# EAGLE design USBASP_M8535 (EAGLE 6.1)
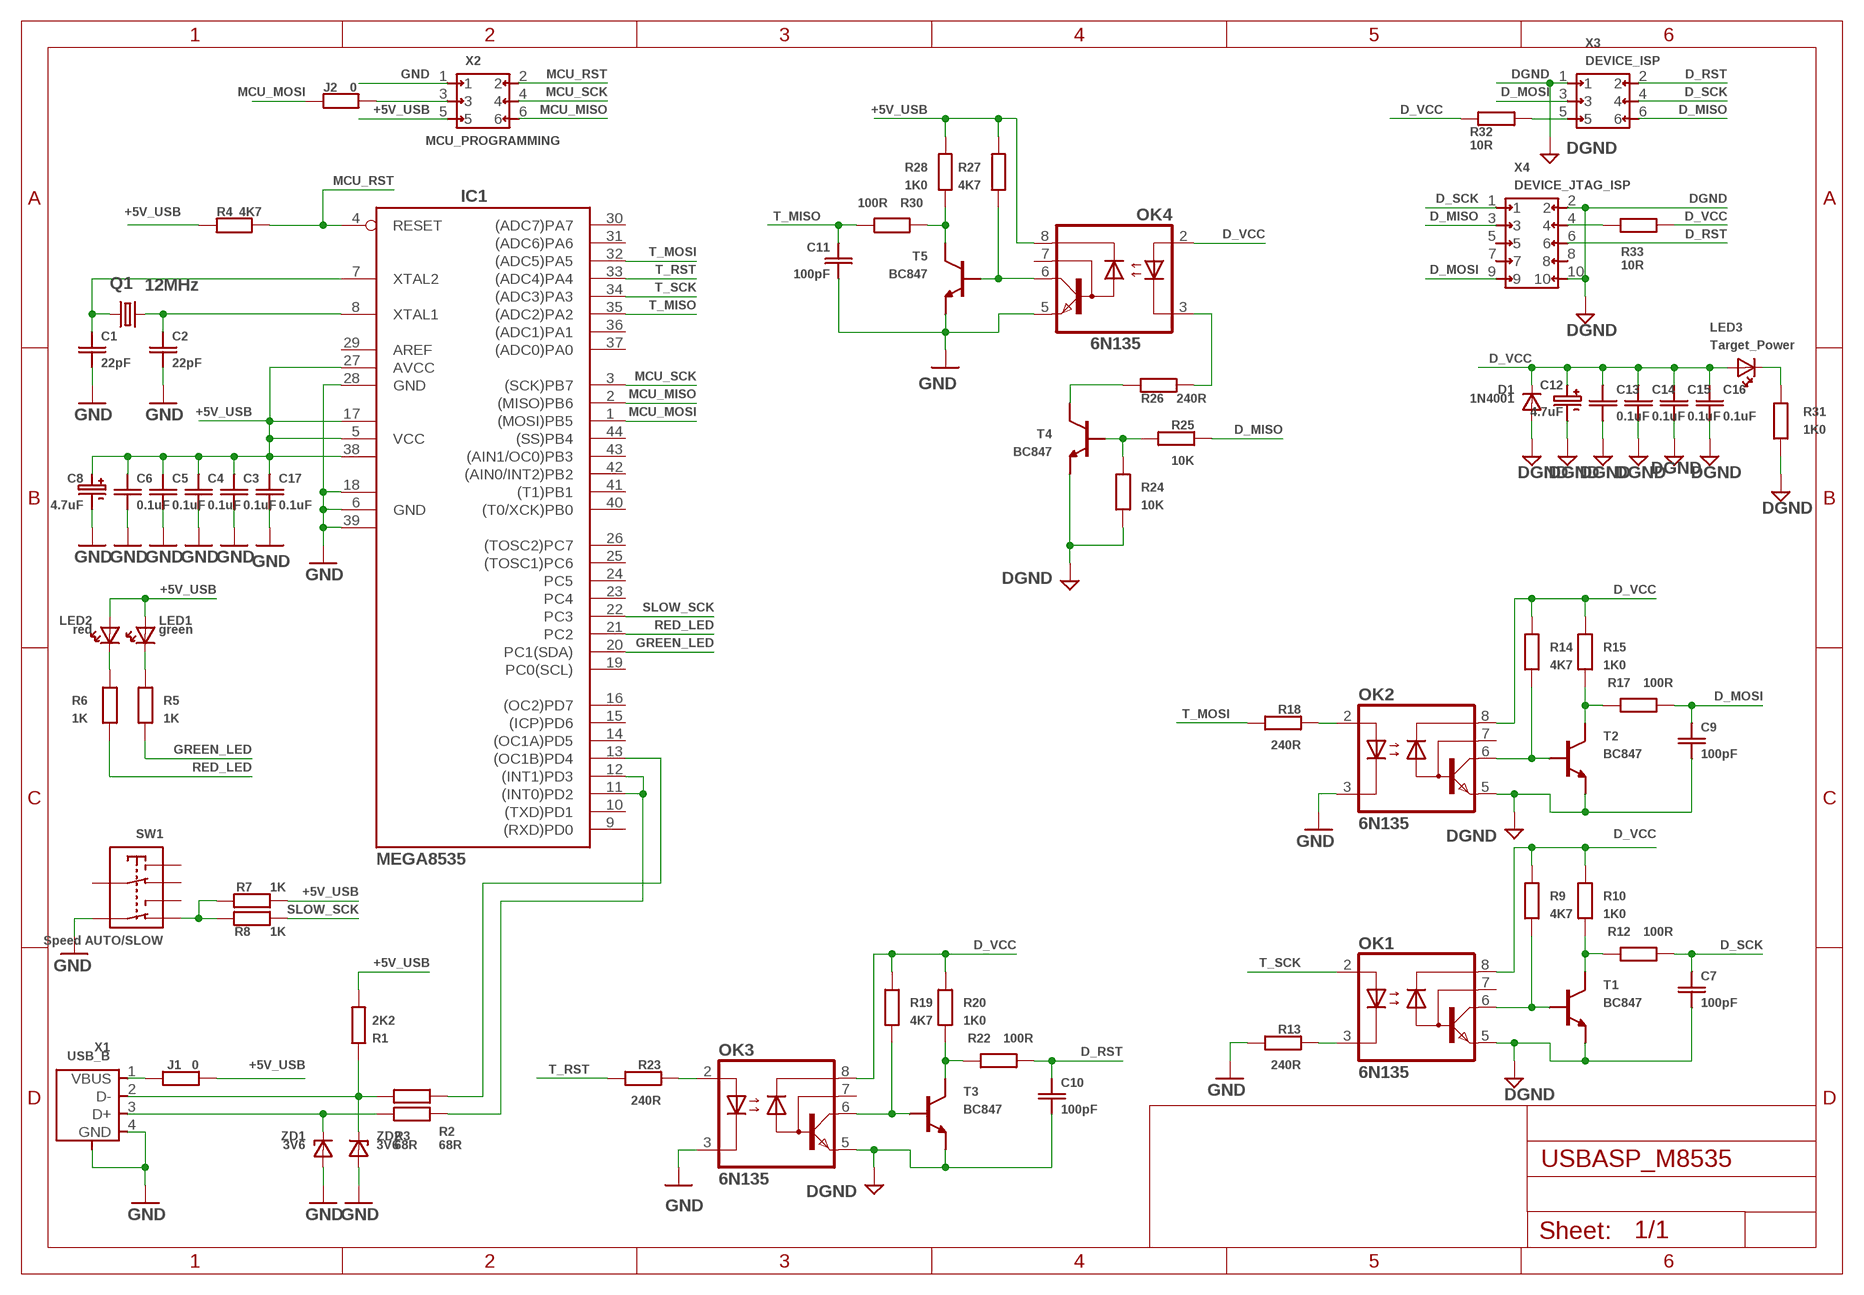
[diagram p0: schematic, sheet 1]

## Parts
C1  22pF  CSMD_0805  [RSMD_0805]
C2  22pF  CSMD_0805  [RSMD_0805]
C3  0.1uF  CSMD_0805  [RSMD_0805]
C4  0.1uF  CSMD_0805  [RSMD_0805]
C5  0.1uF  CSMD_0805  [RSMD_0805]
C6  0.1uF  CSMD_0805  [RSMD_0805]
C7  100pF  CSMD_0805  [RSMD_0805]
C8  4.7uF  CE6.3MM  [CE_6.3MM]
C9  100pF  CSMD_0805  [RSMD_0805]
C10  100pF  CSMD_0805  [RSMD_0805]
C11  100pF  CSMD_0805  [RSMD_0805]
C12  4.7uF  CE6.3MM  [CE_6.3MM]
C13  0.1uF  CSMD_0805  [RSMD_0805]
C14  0.1uF  CSMD_0805  [RSMD_0805]
C15  0.1uF  CSMD_0805  [RSMD_0805]
C16  0.1uF  CSMD_0805  [RSMD_0805]
C17  0.1uF  CSMD_0805  [RSMD_0805]
D1  1N4001  1N4001DO-41_10MM  [DO-41_10MM]
IC1  MEGA8535  MEGA8535-A  [TQFP44]
J1  0  RSMD_1206  [RSMD_1206]
J2  0  RSMD_1206  [RSMD_1206]
LED1  green  LED3MM  [LED3MM]
LED2  red  LED3MM  [LED3MM]
LED3  Target_Power  LED3MM  [LED3MM]
OK1  6N135  [DIL08]
OK2  6N135  [DIL08]
OK3  6N135  [DIL08]
OK4  6N135  [DIL08]
Q1  12MHz  CRYSTALHC49U-V  [HC49U-V]
R1  2K2  RSMD_0805  [RSMD_0805]
R2  68R  RSMD_1206  [RSMD_1206]
R3  68R  RSMD_1206  [RSMD_1206]
R4  4K7  RSMD_0805  [RSMD_0805]
R5  1K  RSMD_0805  [RSMD_0805]
R6  1K  RSMD_0805  [RSMD_0805]
R7  1K  RSMD_0805  [RSMD_0805]
R8  1K  RSMD_1206  [RSMD_1206]
R9  4K7  RSMD_0805  [RSMD_0805]
R10  1K0  RSMD_0805  [RSMD_0805]
R12  100R  RSMD_0805  [RSMD_0805]
R13  240R  RSMD_0805  [RSMD_0805]
R14  4K7  RSMD_0805  [RSMD_0805]
R15  1K0  RSMD_0805  [RSMD_0805]
R17  100R  RSMD_0805  [RSMD_0805]
R18  240R  RSMD_0805  [RSMD_0805]
R19  4K7  RSMD_0805  [RSMD_0805]
R20  1K0  RSMD_0805  [RSMD_0805]
R22  100R  RSMD_0805  [RSMD_0805]
R23  240R  RSMD_0805  [RSMD_0805]
R24  10K  RSMD_0805  [RSMD_0805]
R25  10K  RSMD_0805  [RSMD_0805]
R26  240R  RSMD_0805  [RSMD_0805]
R27  4K7  RSMD_0805  [RSMD_0805]
R28  1K0  RSMD_0805  [RSMD_0805]
R30  100R  RSMD_0805  [RSMD_0805]
R31  1K0  RSMD_0805  [RSMD_0805]
R32  10R  R0207  [R0207]
R33  10R  R0207  [R0207]
SW1  Speed AUTO/SLOW  SWITCH_DOUBLE(2.54X4MM)  [SWITCH_DOUBLE_2.54X4.0MM]
T1  BC847  BC847SOT23_SMALL_PADS  [SOT23_SMALL_PADS]
T2  BC847  BC847SOT23_SMALL_PADS  [SOT23_SMALL_PADS]
T3  BC847  BC847SOT23_SMALL_PADS  [SOT23_SMALL_PADS]
T4  BC847  BC847SOT23_SMALL_PADS  [SOT23_SMALL_PADS]
T5  BC847  BC847SOT23_SMALL_PADS  [SOT23_SMALL_PADS]
X1  USB_B  USB_TYPE_B(TYPE_B)  [USB_TYPE_B]
X2  MCU_PROGRAMMING  PIN2X3_2.54MM  [PIN2X3_2.54MM]
X3  DEVICE_ISP  PIN2X3_2.54MM  [PIN2X3_2.54MM]
X4  DEVICE_JTAG_ISP  PIN2X5_2.54MM  [PIN2X5_2.54MM]
ZD1  3V6  ZENNER(SOD_80)  [SOD-80]
ZD2  3V6  ZENNER(SOD_80)  [SOD-80]

## Nets
+5V_USB: C3.PAD_1(PIN1) C4.PAD_1(PIN1) C5.PAD_1(PIN1) C6.PAD_1(PIN1) C8.+ C17.PAD_1(PIN1) IC1.5(VCC) IC1.17(VCC1) IC1.27(AVCC) IC1.38(VCC2) J1.PAD_0(PIN0) LED1.ANODE LED2.ANODE OK4.8(VCC) R1.PAD_0(PIN0) R4.PAD_0(PIN0) R7.PAD_0(PIN0) R27.PAD_0(PIN0) R28.PAD_0(PIN0) X2.5
D_MISO: R25.PAD_1(PIN1) X3.6 X4.3
D_MOSI: C9.PAD_1(PIN1) R17.PAD_1(PIN1) X3.3 X4.9
D_RST: C10.PAD_1(PIN1) R22.PAD_1(PIN1) X3.2 X4.6
D_SCK: C7.PAD_1(PIN1) R12.PAD_1(PIN1) X3.4 X4.1
D_VCC: C12.+ C13.PAD_1(PIN1) C14.PAD_1(PIN1) C15.PAD_1(PIN1) C16.PAD_1(PIN1) D1.CATHODE LED3.ANODE OK1.8(VCC) OK2.8(VCC) OK3.8(VCC) OK4.2(A) R9.PAD_0(PIN0) R10.PAD_0(PIN0) R14.PAD_0(PIN0) R15.PAD_0(PIN0) R19.PAD_0(PIN0) R20.PAD_0(PIN0) R32.PAD1(PIN1) R33.PAD_0(PIN0)
DGND: C7.PAD_0(PIN0) C9.PAD_0(PIN0) C10.PAD_0(PIN0) C12.- C13.PAD_0(PIN0) C14.PAD_0(PIN0) C15.PAD_0(PIN0) C16.PAD_0(PIN0) D1.ANODE OK1.5(GND) OK2.5(GND) OK3.5(GND) R24.PAD_0(PIN0) R31.PAD_1(PIN1) T1.2(E) T2.2(E) T3.2(E) T4.2(E) X3.1 X4.2 X4.10
GND: C1.PAD_0(PIN0) C2.PAD_0(PIN0) C3.PAD_0(PIN0) C4.PAD_0(PIN0) C5.PAD_0(PIN0) C6.PAD_0(PIN0) C8.- C11.PAD_0(PIN0) C17.PAD_0(PIN0) IC1.6(GND) IC1.18(GND1) IC1.28(GND) IC1.39(GND2) OK2.3(C) OK3.3(C) OK4.5(GND) R13.PAD_0(PIN0) SW1.CENTER2 T5.2(E) X1.4(GND) X1.PACKAGE_PAD1(PACKAGE) X1.PACKAGE_PAD2(PACKAGE) X2.1 ZD1.ANODE ZD2.ANODE
GREEN_LED: IC1.20(PC1(SDA)) R5.PAD_1(PIN1)
MCU_MISO: IC1.2((MISO)PB6) X2.6
MCU_MOSI: IC1.1((MOSI)PB5) J2.PAD_0(PIN0)
MCU_RST: IC1.4(RESET) R4.PAD_1(PIN1) X2.2
MCU_SCK: IC1.3((SCK)PB7) X2.4
N$1: C2.PAD_1(PIN1) IC1.8(XTAL1) Q1.2
N$2: OK1.3(C) R13.PAD_1(PIN1)
N$3: C1.PAD_1(PIN1) IC1.7(XTAL2) Q1.1
N$4: R1.PAD_1(PIN1) R2.PAD_1(PIN1) X1.2(D-) ZD2.CATHODE
N$5: IC1.13((OC1B)PD4) R2.PAD_0(PIN0)
N$6: IC1.11((INT0)PD2) IC1.12((INT1)PD3) R3.PAD_1(PIN1)
N$7: LED1.CATHODE R5.PAD_0(PIN0)
N$8: LED2.CATHODE R6.PAD_0(PIN0)
N$9: R10.PAD_1(PIN1) R12.PAD_0(PIN0) T1.3(C)
N$10: R7.PAD_1(PIN1) R8.PAD_1(PIN1) SW1.POS_B2
N$11: OK1.6(VO) R9.PAD_1(PIN1) T1.1(B)
N$13: OK3.2(A) R23.PAD_1(PIN1)
N$14: R3.PAD_0(PIN0) X1.3(D+) ZD1.CATHODE
N$15: J2.PAD_1(PIN1) X2.3
N$16: R15.PAD_1(PIN1) R17.PAD_0(PIN0) T2.3(C)
N$18: OK2.6(VO) R14.PAD_1(PIN1) T2.1(B)
N$19: J1.PAD_1(PIN1) X1.1(VBUS)
N$20: OK2.2(A) R18.PAD_1(PIN1)
N$21: R32.PAD_0(PIN0) X3.5
N$22: R20.PAD_1(PIN1) R22.PAD_0(PIN0) T3.3(C)
N$24: OK3.6(VO) R19.PAD_1(PIN1) T3.1(B)
N$25: R33.PAD1(PIN1) X4.4
N$26: R26.PAD_0(PIN0) T4.3(C)
N$27: OK4.3(C) R26.PAD_1(PIN1)
N$29: R24.PAD_1(PIN1) R25.PAD_0(PIN0) T4.1(B)
N$30: LED3.CATHODE R31.PAD_0(PIN0)
N$33: R28.PAD_1(PIN1) R30.PAD_0(PIN0) T5.3(C)
N$35: OK4.6(VO) R27.PAD_1(PIN1) T5.1(B)
RED_LED: IC1.21(PC2) R6.PAD_1(PIN1)
SLOW_SCK: IC1.22(PC3) R8.PAD_0(PIN0)
T_MISO: C11.PAD_1(PIN1) IC1.35((ADC2)PA2) R30.PAD_1(PIN1)
T_MOSI: IC1.32((ADC5)PA5) R18.PAD_0(PIN0)
T_RST: IC1.33((ADC4)PA4) R23.PAD_0(PIN0)
T_SCK: IC1.34((ADC3)PA3) OK1.2(A)
Unconnected: IC1.9((RXD)PD0) IC1.10((TXD)PD1) IC1.14((OC1A)PD5) IC1.15((ICP)PD6) IC1.16((OC2)PD7) IC1.19(PC0(SCL)) IC1.23(PC4) IC1.24(PC5) IC1.25((TOSC1)PC6) IC1.26((TOSC2)PC7) IC1.29(AREF) IC1.30((ADC7)PA7) IC1.31((ADC6)PA6) IC1.36((ADC1)PA1) IC1.37((ADC0)PA0) IC1.40((T0/XCK)PB0) IC1.41((T1)PB1) IC1.42((AIN0/INT2)PB2) IC1.43((AIN1/OC0)PB3) IC1.44((SS)PB4) OK1.7(VB) OK2.7(VB) OK3.7(VB) OK4.7(VB) SW1.CENTER1 SW1.POS_A1 SW1.POS_A2 SW1.POS_B1 X4.5 X4.7 X4.8

## Library data of the parts
C1-C7 C9-C11 C13-C17 = __MyCommonLib1:C
C8 C12 = __MyCommonLib1:CE
D1 = __MyCommonLib1:1N4001
IC1 = atmel:MEGA8535: MICROCONTROLLER 8 Kbytes FLASH 512 bytes SRAM 512 bytes EEPROM USART 8-channel 10 bit ADC Source: avr.lbr; MPN: ATMEGA8535-16AU; OC_FARNELL: 1528437; OC_NEWARK: 01M6908
J1 J2 R1-R10 R12-R15 R17-R20 R22-R28 R30-R33 = __MyCommonLib1:R
LED1-LED3 = __MyCommonLib1:LED3MM
OK1-OK4 = optocoupler:6N135: MOTOROLA OPTO COUPLER; MF: FAIRCHILD SEMICONDUCTOR; MPN: 6N135; OC_FARNELL: 1021342; OC_NEWARK: 58K9658
Q1 = crystal:CRYSTAL: CRYSTAL; OC_FARNELL: 1666969; OC_NEWARK: unknown
SW1 = __MyCommonLib1:SWITCH_DOUBLE
T1-T5 = __MyCommonLib1:BC847
X1 = __MyCommonLib1:USB_TYPE_B
X2 X3 = __MyCommonLib1:PIN2X3
X4 = __MyCommonLib1:PIN2X5
ZD1 ZD2 = __MyCommonLib1:ZENNER

## Board
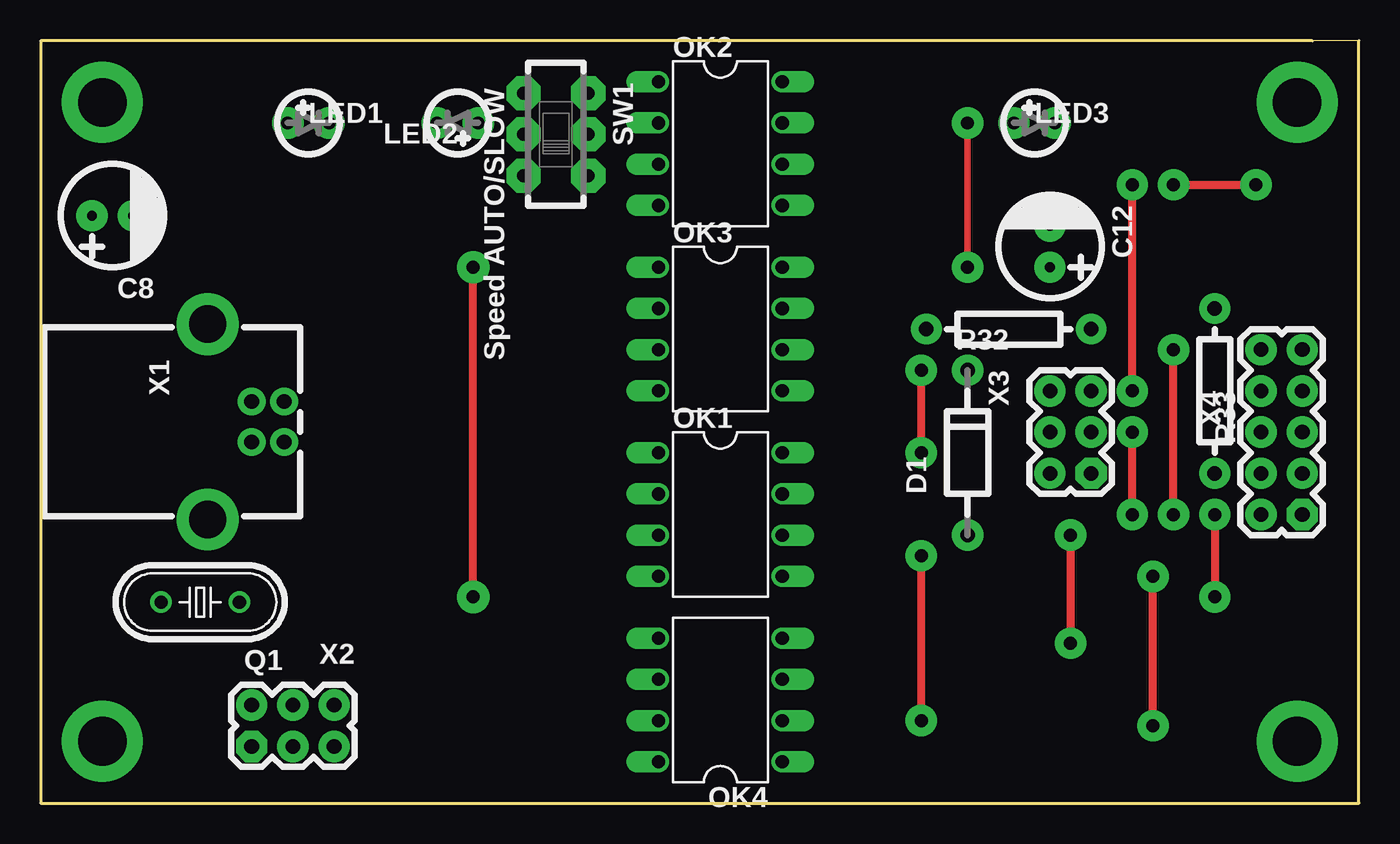
[diagram p1: board, top side]
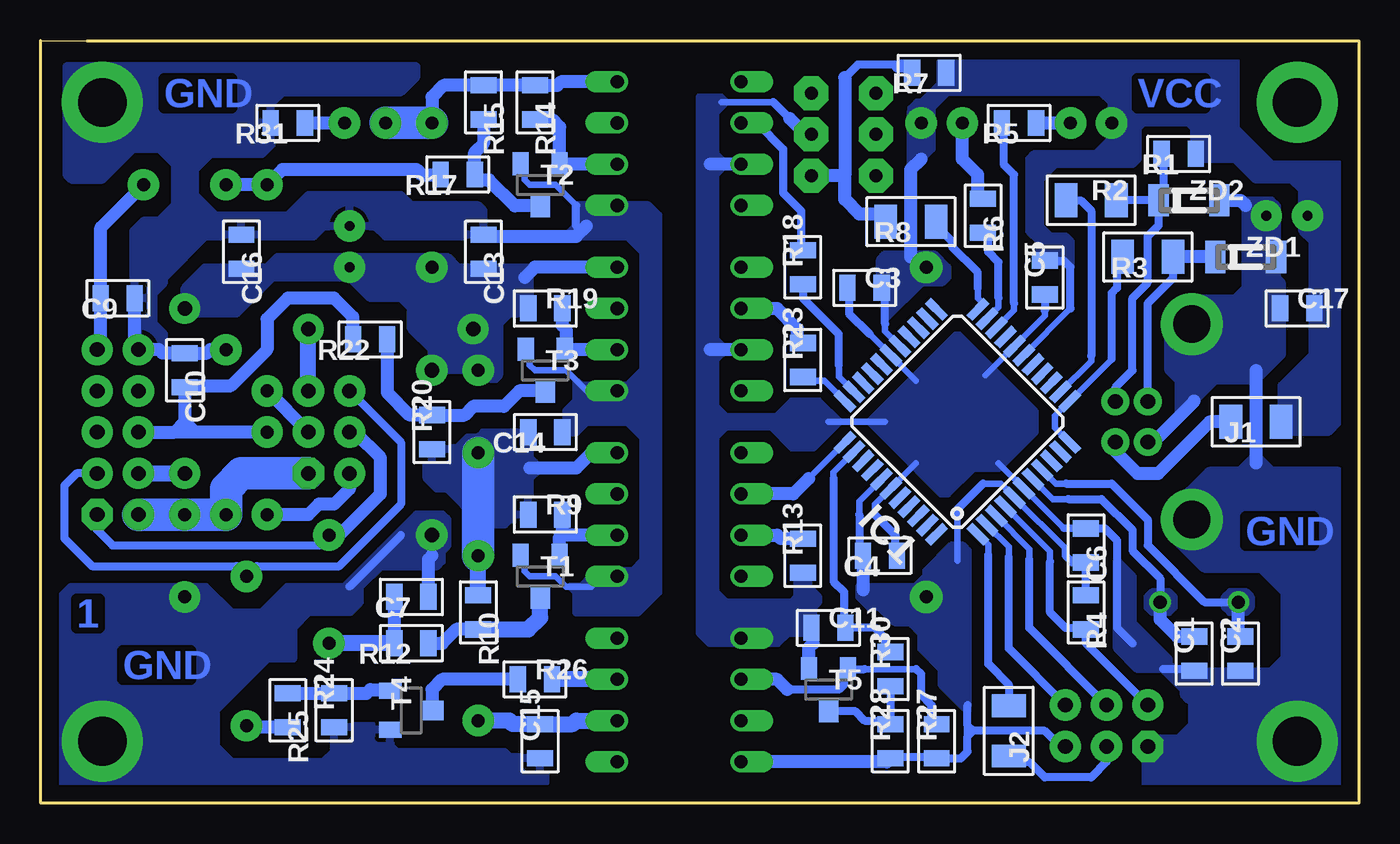
[diagram p2: board, bottom side, seen from below]

Size 81.28 x 46.99 mm. Coordinates in mm from the lower left corner, seen from the top.
Outline: 0,0 81.28,0 81.28,46.99 78.41,46.98 0,46.98 0,0
Copper layers (1*16): Top 0.035mm / dielectric 1.5mm / Bottom 0.035mm
Design rules: minimum track width 0.010159375mm, minimum drill 0.015240625mm, track to track 0.35mm, track to pad 0.35mm, pad to pad 0.25mm, via to via 0.35mm, smd to smd 8mil, copper to edge 40mil, drill to drill 8mil, minimum pad ring 10mil, minimum via ring 8mil, stop-mask expansion 4mil, vias tented up to drill 0mil, thermal gap 10mil

### Footprints (pad centres in the part's own frame; a part is rotated, then mirrored left to right if it is on the bottom)
RSMD_0805 = smd 1 x 1.6: PAD_0 -1.05,0; PAD_1 1.05,0
CE_6.3MM = drill 0.6 pad 1.93: + 1.27,0; - -1.27,0
DO-41_10MM = drill 0.9 pad 1.93: ANODE -5.08,0; CATHODE 5.08,0
TQFP44 = smd 1.5 x 0.5: 1 -5.8,4; 2 -5.8,3.2; 3 -5.8,2.4; 4 -5.8,1.6; 5 -5.8,0.8; 6 -5.8,0; 7 -5.8,-0.8; 8 -5.8,-1.6; 9 -5.8,-2.4; 10 -5.8,-3.2; 11 -5.8,-4; 23 5.8,-4; 24 5.8,-3.2; 25 5.8,-2.4; 26 5.8,-1.6; 27 5.8,-0.8; 28 5.8,0; 29 5.8,0.8; 30 5.8,1.6; 31 5.8,2.4; 32 5.8,3.2; 33 5.8,4 | smd 0.5 x 1.5: 12 -4,-5.8; 13 -3.2,-5.8; 14 -2.4,-5.8; 15 -1.6,-5.8; 16 -0.8,-5.8; 17 0,-5.8; 18 0.8,-5.8; 19 1.6,-5.8; 20 2.4,-5.8; 21 3.2,-5.8; 22 4,-5.8; 34 4,5.8; 35 3.2,5.8; 36 2.4,5.8; 37 1.6,5.8; 38 0.8,5.8; 39 0,5.8; 40 -0.8,5.8; 41 -1.6,5.8; 42 -2.4,5.8; 43 -3.2,5.8; 44 -4,5.8
RSMD_1206 = smd 1.4 x 2.1: PAD_0 -1.55,0; PAD_1 1.55,0
LED3MM = drill 0.8 pad 1.93: ANODE -1.27,0; CATHODE 1.27,0
DIL08 = drill 0.813 offset: 1 -3.81,-3.81; 2 -1.27,-3.81; 3 1.27,-3.81; 4 3.81,-3.81; 5 3.81,3.81; 6 1.27,3.81; 7 -1.27,3.81; 8 -3.81,3.81
HC49U-V = drill 0.813: 1 -2.413,0; 2 2.413,0
R0207 = drill 0.9 pad 1.9: PAD1 5.08,0; PAD_0 -5.08,0
SWITCH_DOUBLE_2.54X4.0MM = drill 0.8 pad 2.1 octagon: CENTER1 0,-2; CENTER2 0,2; POS_A1 -2.54,-2; POS_A2 -2.54,2; POS_B1 2.54,-2; POS_B2 2.54,2
SOT23_SMALL_PADS = smd 1 x 1.4: 1 1.2,1.3; 2 -1.2,1.3 | smd 1.2 x 1.4: 3 0,-1.3
USB_TYPE_B = drill 0.9 pad 1.7: 1 1.25,2; 2 -1.25,2; 3 -1.25,0; 4 1.25,0 | drill 2.3 pad 3.81: PACKAGE_PAD1 -6.02,-2.71; PACKAGE_PAD2 6.02,-2.71
PIN2X3_2.54MM = drill 0.9 pad 1.93 octagon: 1 -2.54,-1.27 | drill 0.9 pad 1.93: 2 -2.54,1.27; 3 0,-1.27; 4 0,1.27; 5 2.54,-1.27; 6 2.54,1.27
PIN2X5_2.54MM = drill 0.9 pad 1.93 octagon: 1 -5.08,-1.27 | drill 0.9 pad 1.93: 2 -5.08,1.27; 3 -2.54,-1.27; 4 -2.54,1.27; 5 0,-1.27; 6 0,1.27; 7 2.54,-1.27; 8 2.54,1.27; 9 5.08,-1.27; 10 5.08,1.27
SOD-80 = smd 1.25 x 2: ANODE 1.875,0; CATHODE -1.875,0

### Placement (x,y rotation side)
C1  10.16,9.21 90 bottom
C2  7.3,9.21 90 bottom
C3  30.48,31.75 0 bottom
C4  29.53,15.24 180 bottom
C5  19.37,32.38 90 bottom
C6  16.83,15.88 270 bottom
C7  58.42,12.7 180 bottom
C8  4.45,36.2 180 top
C9  76.52,31.11 180 bottom
C10  72.39,26.67 270 bottom
C11  32.7,10.79 0 bottom
C12  62.23,34.29 270 top
C13  53.98,33.97 270 bottom
C14  50.16,22.86 180 bottom
C15  50.48,3.81 90 bottom
C16  68.9,33.97 270 bottom
C17  3.81,30.48 0 bottom
D1  57.15,21.59 90 top
IC1  24.77,23.5 135 bottom
J1  6.35,23.5 180 bottom
J2  21.59,4.45 270 bottom
LED1  16.51,41.91 0 top
LED2  25.72,41.91 180 top
LED3  61.28,41.91 0 top
OK1  41.91,17.78 270 top
OK2  41.91,40.64 270 top
OK3  41.91,29.21 270 top
OK4  41.91,6.35 90 top
Q1  9.84,12.38 180 top
R1  11.11,40.01 180 bottom
R2  16.51,37.15 0 bottom
R3  13.02,33.66 180 bottom
R4  16.83,11.75 270 bottom
R5  20.95,41.91 180 bottom
R6  23.18,36.2 270 bottom
R7  26.5,45 180 bottom
R8  27.62,35.83 180 bottom
R9  50.16,17.78 0 bottom
R10  54.29,11.75 270 bottom
R12  58.42,9.84 180 bottom
R13  34.29,15.24 90 bottom
R14  50.8,43.18 270 bottom
R15  53.98,43.18 270 bottom
R17  55.56,38.73 180 bottom
R18  34.29,33.02 90 bottom
R19  50.16,30.48 0 bottom
R20  57.15,22.86 90 bottom
R22  60.96,28.57 180 bottom
R23  34.29,27.3 90 bottom
R24  63.18,5.71 90 bottom
R25  66.04,5.71 270 bottom
R26  50.8,7.62 0 bottom
R27  26.04,3.81 90 bottom
R28  28.89,3.81 90 bottom
R30  28.89,8.26 90 bottom
R31  66.04,41.91 180 bottom
R32  59.69,29.21 180 top
R33  72.39,25.4 270 top
SW1  31.77,41.21 270 top
T1  50.48,13.97 0 bottom
T2  50.48,38.1 0 bottom
T3  50.16,26.67 0 bottom
T4  58.42,5.71 90 bottom
T5  32.7,6.99 0 bottom
X1  13.02,23.5 270 top
X2  15.56,4.76 0 top
X3  63.5,22.86 90 top
X4  76.52,22.86 90 top
ZD1  6.99,33.66 0 bottom
ZD2  10.48,37.15 0 bottom

### Tracks (layer width: path | path; a pad name or v marks a point on that pad's centre or on a via)
+5V_USB  (via drill 0.8 pad 2)
  Top 0.5: v26.67,12.7 v26.67,33.02
  Bottom 0.4: 18.1,15.7 IC1.5 22.09,19.68 23.18,19.68 | 24.77,18.1 24.77,14.92 | IC1.38 30.8,18.59 30.8,17.78 | IC1.17 17.78,30.48 | IC1.27 29.21,29.07 29.21,29.53
  Bottom 0.5: 29.11,2.54 R28.PAD_0 28.8,2.86 26.13,2.86 R27.PAD_0 24.55,2.76 24.13,3.17 24.13,4.13 | 18.1,15.7 18.1,15.24 17.68,14.82 C6.PAD_1 R4.PAD_0 | 23.18,19.68 24.77,18.1 | 17.78,30.48 17.78,33.02 18.2,33.44 C5.PAD_1 | X2.5 18.41,3.49 19.37,4.45 23.81,4.45 | 30.8,17.78 30.8,15.46 arc-90 C4.PAD_1 | 24.13,4.13 23.81,4.45 | 23.81,4.45 24.13,4.76 | 24.13,4.76 24.13,4.13 | 24.13,4.76 24.13,6.03 | 29.21,29.53 29.21,31.11 29.43,31.34 C3.PAD_1
  Bottom 0.8: 27.62,33.66 27.62,39.05 26.99,39.69 | C4.PAD_1 30.58,13.12 | 29.11,2.54 OK4.8
  pour Bottom (no thermals): 4.76,22.86 4.76,25.72 2.86,27.62 2.86,34.61 3.49,35.24 3.49,37.78 4.13,38.42 6.35,38.42 7.62,39.69 9.84,39.69 10.16,40.01 10.16,41.59 10.48,41.91 13.34,41.91 13.65,41.59 13.65,39.69 13.97,39.37 18.73,39.37 19.68,38.42 19.68,35.56 19.05,34.92 18.1,34.92 17.78,34.61 17.78,33.02 18.1,33.34 19.68,33.34 19.68,34.61 20.32,35.24 20.32,39.69 20,40.01 16.19,40.01 15.24,40.96 15.24,43.18 15.88,43.81 25.4,43.81 26.35,42.86 26.35,40.32 27.62,39.05 27.62,42.55 27.6,42.8 27.2,43.2 26.9,43.2 25.8,44.3 25.8,45.7 25.46,45.7 25.45,45.72 7.62,45.72 7.62,41.59 5.4,39.37 1.27,39.37 1.27,23.5 1.91,22.86
  pour Bottom (no thermals): 24.13,5.71 25.72,7.3 25.72,8.26 26.99,9.53 26.99,10.48 27.62,11.11 28.57,11.11 29.53,12.06 30.16,12.06 30.8,12.7 30.8,13.34 27.3,13.34 26.67,13.97 26.67,14.29 25.08,15.88 24.45,15.88 24.13,15.56
  pour Bottom (no thermals): 25.4,32.38 25.72,32.07 26.99,32.07 29.21,29.84 29.21,31.11 29.53,31.43 29.53,33.49 29.21,33.81 26.19,33.81 25.4,33.02
D_MISO  (via drill 0.8 pad 1.93)
  Top 0.5: v68.58,4.76 v68.58,13.97
  Bottom 0.5: X3.6 59.05,22.23 59.05,18.41 62.87,14.61 67.94,14.61 v68.58,13.97 69.22,14.61 78.11,14.61 79.81,16.31 79.81,19.57 79.06,20.32 X4.3
  Bottom 0.8: R25.PAD_1 68.48,4.67 v68.58,4.76
D_MOSI  (via drill 0.8 pad 1.93)
  Top 0.5: v69.85,38.1 v74.93,38.1 | v67.31,25.4 v67.31,38.1
  Bottom 0.8: X3.3 v67.31,25.4 | X4.9 77.57,28.16 C9.PAD_1 77.57,35.46 v74.93,38.1 | R17.PAD_1 57.78,38.73 58.1,39.05 66.36,39.05 v67.31,38.1 v69.85,38.1
D_RST  (via drill 0.8 pad 1.93)
  Top 0.5: v67.31,17.78 v67.31,22.86
  Bottom 0.8: X4.6 73.03,22.86 | 73.03,22.86 72.39,23.5 | 72.39,23.5 71.75,22.86 | 71.75,22.86 73.03,22.86 | v67.31,22.86 71.75,22.86 | 72.39,23.5 C10.PAD_1 72.29,25.72 69.53,25.72 67.31,27.94 67.31,29.84 66.04,31.11 63.18,31.11 62.01,29.94 R22.PAD_1 | X3.2 62.23,19.37 63.18,18.41 64.14,18.41 64.77,17.78 v67.31,17.78
D_SCK  (via drill 0.8 pad 1.93)
  Top 0.5: v63.5,16.51 v63.5,9.84
  Bottom 0.5: X4.1 77.79,16.83 76.83,15.88 64.14,15.88 v63.5,16.51
  Bottom 0.8: C7.PAD_1 R12.PAD_1 | v63.5,16.51 62.87,16.51 60.33,19.05 60.33,21.27 61.91,22.86 X3.4
  Bottom 1: R12.PAD_1 v63.5,9.84
D_VCC  (via drill 0.8 pad 1.93)
  Top 0.4: v57.15,33.02 v57.15,41.91
  Top 0.5: v54.29,5.08 v54.29,15.24 | v54.29,21.59 v54.29,26.67
  Bottom 0.4: C13.PAD_1 54.07,33.02
  Bottom 0.8: v57.15,41.91 57.15,43.5 56.42,44.23 R15.PAD_0 R14.PAD_0 49.43,44.23 49.21,44.45 OK2.8 | OK1.8 47.31,21.59 48.26,20.64 51.12,20.64 | OK3.8 50.8,33.02 51.44,32.38
  Bottom 1: OK4.2 48.26,5.08 48.48,4.86 C15.PAD_1 52.17,4.86 52.39,5.08 v54.29,5.08 | R10.PAD_0 v54.29,15.24
  Bottom 2: v54.29,21.59 v54.29,15.24 | v57.15,41.91 LED3.ANODE
  pour Bottom: 51.12,17.46 52.39,17.46 52.7,17.14 54.29,17.14 54.29,17.46 56.2,19.37 56.83,19.37 57.47,20 57.47,21.59 57.15,21.91 55.56,21.91 54.93,22.54 54.29,22.54 53.98,22.86 51.12,22.86 51.12,21.27 50.48,20.64 51.12,20
  pour Bottom (no thermals): 54.29,26.67 57.15,26.67 57.15,27.94 58.42,29.21 58.42,30.48 59.05,31.11 60.96,31.11 62.23,32.38 66.99,32.38 69.22,30.16 72.39,30.16 72.39,31.75 71.12,33.02 67.31,33.02 66.67,33.66 56.2,33.66 55.56,33.02 51.12,33.02 51.12,30.16 52.39,30.16 53.02,29.53 53.02,26.35 53.34,26.04
DGND  (via drill 0.8 pad 1.93, 3 pad 5)
  Top 0.5: v72.39,17.78 v72.39,12.7 | v69.85,17.78 v69.85,27.94
  Bottom 0.4: T1.2 51.44,15.02 51.44,14.29 51.12,13.97 49.53,13.97 48.9,13.34 47.31,13.34 | T3.2 51.12,27.72 51.12,26.99 50.8,26.67 48.9,26.67 47.62,25.4 | T2.2 51.44,39.15 51.44,38.42 51.12,38.1 49.53,38.1 48.26,36.83
  Bottom 0.5: 48.26,35.56 48.26,36.83 | 59.05,16.51 62.23,13.34
  Bottom 0.8: C7.PAD_0 57.37,15.02 57.15,15.24 | v69.85,27.94 70.8,27.94 71.02,27.72 C10.PAD_0 73.76,27.72 73.98,27.94 X4.10 75.47,28.16 C9.PAD_0 | C13.PAD_0 53.88,34.92 48.26,34.92 47.62,35.56
  Bottom 2: X3.1 68.9,20.32 69.85,19.37 v69.85,17.78 v72.39,17.78 X4.2
  other vias: 77.47,43.18 77.47,3.81
  pour Bottom (no thermals): 43.81,36.83 48.26,36.83 48.26,35.56 48.9,34.92 45.09,34.92 44.13,33.97 44.13,26.67 45.09,25.72 47.94,25.72 48.26,26.04 48.26,24.77 48.9,24.13 48.9,22.86 48.26,22.86 47.62,23.5 45.09,23.5 44.13,22.54 44.13,14.92 44.77,14.29 47.31,14.29 47.31,13.97 47.94,13.34 48.58,13.34 48.26,13.02 48.26,11.75 44.45,11.75 43.18,13.02 43.18,36.2
  pour Bottom: 50.16,2.86 50.16,1.27 80.01,1.27 80.01,12.7 79.38,13.34 71.12,13.34 69.53,11.75 67.63,11.75 66.04,13.34 62.55,13.34 60.33,15.56 60.33,14.61 61.59,13.34 61.59,12.38 62.23,11.75 64.77,11.75 65.72,10.79 65.72,8.89 67.31,8.89 70.48,5.71 70.48,3.49 69.53,2.54 63.82,2.54 63.18,3.17 63.18,4.76 60.01,4.76 59.69,4.45 59.69,3.49 59.37,3.17 52.7,3.17 52.39,2.86
  pour Bottom (no thermals): 60.33,14.61 56.83,14.61 56.52,14.92 56.52,15.56 56.2,15.88 56.2,17.46 56.52,17.78 58.1,17.78 60.33,15.56
  pour Bottom: 79.69,45.4 79.69,38.73 79.38,38.42 77.47,38.42 75.56,40.32 73.98,40.32 73.03,39.37 73.03,36.83 73.98,35.88 74.93,35.88 75.56,35.24 75.56,28.26 75.25,27.94 73.66,27.94 73.66,28.89 74.3,29.53 74.3,31.43 73.66,32.07 73.66,32.38 71.12,34.92 64.45,34.92 63.82,35.56 60.64,35.56 60.01,34.92 53.98,34.92 53.98,36.51 54.29,36.83 58.42,36.83 59.05,37.47 64.77,37.47 66.04,36.2 70.48,36.2 71.75,37.47 71.75,39.05 70.8,40.01 67.63,40.01 66.99,40.64 66.99,43.18 66.36,43.81 59.05,43.81 58.1,44.77 58.1,45.4
GND  (via drill 3 pad 5)
  Bottom 0.4: 32.7,23.5 29.21,23.5 | 18.2,16.93 IC1.6 22.23,20.95 | 27.3,20.95 IC1.39 29.84,18.41 29.84,17.78 | 19.37,30.34 19.37,30.02 IC1.18 23.04,26.35 | 27.3,26.04 IC1.28 30.16,28.89 | 30.16,28.89 | 36.1,43.2 39.3,43.2
  Bottom 0.45: C6.PAD_0 18.2,16.93
  Bottom 0.5: C6.PAD_0 15.65,16.93 14.92,16.19 14.92,10.79 13.97,9.84 | C5.PAD_0 19.37,30.34 | C3.PAD_0 31.43,31.65 31.43,30.16 30.16,28.89 | C1.PAD_0 10.26,8.26 12.06,8.26 | 29.84,17.78 28.57,16.51 28.57,15.34 C4.PAD_0 | 35.1,42.2 36.1,43.2
  Bottom 0.8: X1.4 12.68,22.25 10.16,24.77 | 6.35,26.67 6.35,20.95 | ZD2.ANODE 7.3,37.15 6.99,36.83 | T5.2 33.9,9.6 33.66,9.84 33.66,10.7 C11.PAD_0 | OK2.3 40.01,39.37 | OK3.3 40.01,27.94 | SW1.CENTER2 34.11,41.21 35.1,42.2
  other vias: 3.81,3.81
  pour Bottom: 22.23,20.64 23.81,20.64 25.4,19.05 25.72,19.05 30.16,23.5 24.77,28.89 20,24.13 20,22.86
  pour Bottom (no thermals): 4.76,32.07 4.76,27.62 6.35,26.04 8.89,26.04 10.16,24.77 10.48,24.77 11.11,24.13 11.11,26.04 11.75,26.67 11.75,30.16 10.79,31.11 7.62,31.11 6.99,31.75 6.99,37.15 5.4,37.15 5.08,36.83 5.08,32.38
  pour Bottom (no thermals): 1.27,20.32 5.4,20.32 6.35,21.27 7.3,20.32 9.21,20.32 11.43,18.1 11.43,16.51 9.53,14.61 6.03,14.61 4.45,13.02 4.45,8.89 5.4,7.94 10.16,7.94 10.16,4.76 11.11,3.81 13.02,3.81 13.02,1.27 1.27,1.27
  pour Bottom (no thermals): 11.43,8.26 10.16,8.26 10.16,6.35 10.48,6.35 10.79,6.67 10.79,6.99 12.06,8.26 13.65,8.26 14.92,9.53 14.92,14.92 13.97,13.97 13.97,11.11 11.75,8.89 11.75,8.57
  pour Bottom (no thermals): 33.66,10.48 35.24,10.48 35.88,9.84 40.01,9.84 40.64,10.48 40.64,43.5 39.37,43.5 39.05,43.18 39.69,42.55 39.69,40.01 39.05,39.37 39.69,38.73 39.69,28.57 39.05,27.94 39.69,27.3 39.69,24.45 39.05,23.81 35.88,23.81 34.92,24.77 33.34,24.77 32.07,23.5 33.66,21.91 34.92,21.91 36.2,23.18 39.05,23.18 39.69,22.54 39.69,13.02 39.05,12.38 34.92,12.38 34.61,12.7 34.61,14.29 33.97,14.29 33.97,13.34 33.34,12.7 33.34,12.38 33.66,12.06
GREEN_LED
  Bottom 0.4: IC1.20 21.27,30.38 21.27,30.8
  Bottom 0.5: 21.27,30.8 21.27,38.73 21.91,39.37 21.91,41.81 R5.PAD_1
MCU_MISO
  Bottom 0.4: IC1.2 21.59,15.79 21.59,15.16
  Bottom 0.5: 21.59,15.16 21.59,9.53 X2.6
MCU_MOSI
  Bottom 0.4: IC1.1 22.86,15.93 22.86,15.3
  Bottom 0.5: 22.86,15.3 22.86,8.57 21.59,7.3 J2.PAD_0
MCU_RST
  Bottom 0.4: IC1.4 19.05,15.52 19.05,14.88
  Bottom 0.5: R4.PAD_1 17.05,10.7 17.14,10.79 18.1,10.79 19.05,11.75 19.05,14.88 | X2.2 16.83,9.84 R4.PAD_1 | R4.PAD_1 16.83,10.79
MCU_SCK
  Bottom 0.4: IC1.3 20.32,15.66 20.32,15.02
  Bottom 0.5: X2.4 20.32,10.79 20.32,15.02
N$1
  Bottom 0.4: IC1.8 18.69,19.68 18.06,19.68
  Bottom 0.5: 18.06,19.68 15.24,19.68 13.02,17.46 13.02,15.88 9.53,12.38 7.62,12.38
  Bottom 0.8: C2.PAD_1 7.43,10.38 Q1.2
  pour Bottom (no thermals): 6.99,13.02 6.67,12.7 6.67,12.06 6.99,11.75 7.94,11.75 8.26,12.06 8.26,12.7 7.94,13.02
N$2
  Bottom 0.8: OK1.3 35.88,16.51 35.66,16.29 R13.PAD_1
N$3
  Bottom 0.4: IC1.7 18.87,18.73 17.92,18.73
  Bottom 0.5: 17.92,18.73 15.88,18.73 13.97,16.83 13.97,15.56 12.26,13.84 Q1.1
  Bottom 0.8: C1.PAD_1 11.21,10.26 12.26,11.3 Q1.1
  pour Bottom (no thermals): 12.7,13.02 11.75,13.02 11.43,12.7 11.43,12.06 11.75,11.75 12.7,11.75 13.02,12.06 13.02,12.7
N$4
  Bottom 0.5: X1.2 15.02,25.62 13.97,26.67 13.97,31.11 13.02,32.07 13.02,34.92 12.35,35.59 ZD2.CATHODE 12.38,37.18 | R1.PAD_1 12.06,39.91 12.06,37.47 12.1,37.47 12.38,37.18 | 12.38,37.18 12.41,37.15 R2.PAD_1
N$5
  Bottom 0.4: IC1.13 16.51,27.23 16.51,27.54
  Bottom 0.5: R2.PAD_0 17.14,37.15 16.51,36.51 16.51,27.54
N$6
  Bottom 0.4: IC1.11 18.73,23.12 18.73,23.87 IC1.12 15.24,27.36
  Bottom 0.5: 15.24,27.36 15.24,31.43 14.92,31.75 14.92,33.3 R3.PAD_1
N$7
  Bottom 0.5: 20.1,41.91 R5.PAD_0
  Bottom 0.8: R5.PAD_0 LED1.CATHODE
N$8
  Bottom 0.8: R6.PAD_0 23.5,37.56 23.5,38.73 24.45,39.69 LED2.CATHODE
N$9
  Bottom 0.5: T1.3 50.51,12.7
  Bottom 0.8: R10.PAD_1 55.66,10.7 56.52,9.84 R12.PAD_0
  Bottom 1: R10.PAD_1 51.22,10.7 50.48,11.43 T1.3
N$10
  Bottom 0.5: 28.4,45.4 28.5,45.5 30.9,45.5 31.7,44.7
  Bottom 0.8: R7.PAD_1 27.95,45.4 28.4,45.4 | R8.PAD_1 29.64,36.3 30.8,36.3 31.7,37.2 31.7,38.7 | SW1.POS_B2 33.73,38.7 31.7,38.7 | 31.7,44.7 31.7,38.7
N$11
  Bottom 0.8: R9.PAD_1 49.12,16.61 | 49.12,16.61 49.28,16.44 T1.1 | OK1.6 49.02,16.51 49.12,16.61
N$13
  Bottom 0.8: OK3.2 35.88,30.48 34.61,29.21 34.61,28.67 R23.PAD_1
N$14
  Bottom 0.5: X1.3 13.02,30.8 11.47,32.35 R3.PAD_0
  Bottom 0.8: ZD1.CATHODE R3.PAD_0
N$15
  Bottom 0.5: X2.3 15.56,2.54 16.51,1.59 19.37,1.59 20.32,2.54 21.59,2.54 J2.PAD_1
N$16
  Bottom 0.8: T2.3 52.04,36.8 53.66,38.42 54.29,38.42 54.51,38.64 R17.PAD_0 54.51,40.1 53.98,40.64 R15.PAD_1
N$18
  Bottom 0.8: OK2.6 49.25,39.37 T2.1 49.28,41.66 49.75,42.13 R14.PAD_1
N$19
  Bottom 0.8: X1.1 15.02,21.68 13.65,20.32 12.38,20.32 9.21,23.5 J1.PAD_1
N$20
  Bottom 0.5: OK2.2 37.11,41.91 35.5,40.3 35.5,37.6 34.4,36.5 34.4,34.2 34.29,34.09 R18.PAD_1
N$21
  Bottom 1: X3.5 R32.PAD_0
N$22
  Bottom 0.5: T3.3 50.2,25.4
  Bottom 0.8: 50.2,25.4 51.75,25.4 52.7,24.45 54.61,24.45 55.15,23.91 R20.PAD_1 58.52,23.91 59.91,25.3 R22.PAD_0
N$24
  Bottom 0.8: OK3.6 45.75,27.97 T3.1 48.9,28.04 48.9,29.21 49.12,29.43 R19.PAD_1
N$25
  Bottom 1: X4.4 R33.PAD1
N$26
  Bottom 0.8: R26.PAD_0 56.52,7.62 57.15,6.99 57.15,5.75 T4.3
N$27
  Bottom 1: OK4.3 R26.PAD_1
N$29
  Bottom 0.8: T4.1 59.79,6.99 60.96,6.99 61.18,6.76 R24.PAD_1 R25.PAD_0
N$30
  Bottom 0.8: R31.PAD_0 LED3.CATHODE
N$32  (via drill 3 pad 5)
  other vias: 3.81,43.18
N$33
  Bottom 0.5: R30.PAD_0 R28.PAD_1 29.11,5.08 30.48,5.08 31.09,5.68 T5.3
N$35
  Bottom 0.4: 27.3,8.26 30.48,8.26
  Bottom 0.5: R27.PAD_1 26.35,4.86 26.35,6.03 26.99,6.67 26.99,7.94 27.3,8.26 | 30.48,8.26 31.47,8.26 T5.1 31.75,8.04 31.75,7.3 32.07,6.99 35.24,6.99
  Bottom 0.8: 35.24,6.99 35.88,7.62 OK4.6
RED_LED
  Bottom 0.4: IC1.21 22.23,30.56 22.23,31.11
  Bottom 0.5: 22.23,31.11 22.23,33.34 22.86,33.97 22.86,34.83 R6.PAD_1
SLOW_SCK
  Bottom 0.4: IC1.22 23.18,30.74 23.18,30.8 23.5,31.11 23.5,31.75
  Bottom 0.5: 23.5,31.75 23.5,32.7 25.08,34.29 25.08,34.61 25.72,35.24 25.72,35.48 | 25.72,36.48 25.72,35.48 | R8.PAD_0 25.72,35.48
T_MISO
  Bottom 0.4: IC1.35 32.38,20.4 32.38,20
  Bottom 0.5: R30.PAD_1 29.21,9.3 29.21,10.16 29.84,10.79 C11.PAD_1 31.75,10.89 31.75,13.02 32.38,13.65 32.38,20
T_MOSI
  Bottom 0.4: IC1.32 32.07,26.27 32.07,26.99
  Bottom 0.5: 32.07,26.99 32.07,28.89 34.29,31.11 R18.PAD_0
T_RST
  Bottom 0.4: IC1.33 32.96,26.04 34.07,26.04 R23.PAD_0
T_SCK
  Bottom 0.4: IC1.34 33.91,20
  Bottom 0.8: 33.91,20 34.87,19.05 OK1.2

### Text on the board
Bottom: VCC | GND | GND | 1 | GND